# EAGLE schematic eagle0_komponenty (EAGLE 8.7.1)
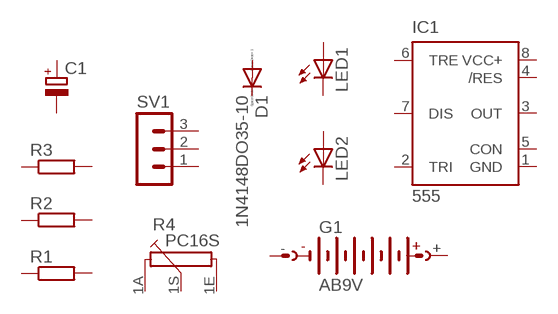
[diagram p0: schematic, sheet 1]

## Parts
C1  CPOL-EUE3.5-8  [E3,5-8]
D1  1N4148DO35-10  [DO35-10]
G1  AB9V  [AB9V]
IC1  555  555P  [DIP08]
LED1  LED3MM  [LED3MM]
LED2  LED3MM  [LED3MM]
R1  R-EU_0207/10  [0207/10]
R2  R-EU_0207/10  [0207/10]
R3  R-EU_0207/10  [0207/10]
R4  PC16S  [PC16S]
SV1  MA03-1  [MA03-1]
Unconnected: C1.+ C1.- D1.A D1.C G1.+ G1.- IC1.2(TRI) IC1.3(OUT) IC1.4(/RES) IC1.5(CON) IC1.6(TRE) IC1.7(DIS) LED1.A LED1.K(C) LED2.A LED2.K(C) R1.1 R1.2 R2.1 R2.2 R3.1 R3.2 R4.1A R4.1E R4.1S SV1.1 SV1.2 SV1.3

## Power pins joined to a net without a drawn wire
GND: IC1.1(GND)
VCC+: IC1.8(VCC+)

## Library data of the parts
C1 = rcl:CPOL-EU: POLARIZED CAPACITOR, European symbol; SPICEPREFIX: C
D1 = diode:1N4148: DIODE high speed (Philips)
G1 = battery:AB9V: 9-V BATTERY CLIP
IC1 = SparkFun-IC-Special-Function:555: General purpose bipolar Timer Datasheet <http://www.sparkfun.com/datasheets/Components/General/ne555.pdf> SparkFun Products SparkFun SparkPunk Sequencer Kit <https://www.sparkfun.com/products/12707> (KIT-12707) Storefront Component: 555 Timer <https://www.sparkfun.com/products/9273> (COM-09273) Two parts valid for production: VFP: IC-11930 (M7555 PTH) VFP: IC-09173 (555 PTH) - Preferred; PROD_ID: IC-09173; PROD_ID_ALT: IC-09173
LED1 LED2 = led:LED: LED OSRAM: - CHIPLED LG R971, LG N971, LY N971, LG Q971, LY Q971, LO R971, LY R971 LH N974, LH R974 LS Q976, LO Q976, LY Q976 LO Q996 - Hyper CHIPLED LW Q18S LB Q993, LB Q99A, LB R99A - SideLED LS A670, LO A670, LY A670, LG A670, LP A670 LB A673, LV A673, LT A673, LW A673 LH A674 LY A675 LS A676, LA A676, LO A676, LY A676, LW A676 LS A679, LY A679, LG A679 - Hyper Micro SIDELED® LS Y876, LA Y876, LO Y876, LY Y876 LT Y87S - SmartLED LW L88C, LW L88S LB L89C, LB L89S, LG L890 LS L89K, LO L89K, LY L89K LS L896, LA L896, LO L896, LY L896 - TOPLED LS T670, LO T670, LY T670, LG T670, LP T670 LSG T670, LSP T670, LSY T670, LOP T670, LYG T670 LG T671, LOG T671, LSG T671 LB T673, LV T673, LT T673, LW T673 LH T674 LS T676, LA T676, LO T676, LY T676, LB T676, LH T676, LSB T676, LW T676 LB T67C, LV T67C, LT T67C, LS T67K, LO T67K, LY T67K, LW E67C LS E67B, LA E67B, LO E67B, LY E67B, LB E67C, LV E67C, LT E67C LW T67C LS T679, LY T679, LG T679 LS T770, LO T770, LY T770, LG T770, LP T770 LB T773, LV T773, LT T773, LW T773 LH T774 LS E675, LA E675, LY E675, LS T675 LS T776, LA T776, LO T776, LY T776, LB T776 LHGB T686 LT T68C, LB T68C - Hyper Mini TOPLED® LB M676 - Mini TOPLED Santana® LG M470 LS M47K, LO M47K, LY M47K Source: http://www.osram.convergy.de LUXEON: - LUMILED® LXK2-PW12-R00, LXK2-PW12-S00, LXK2-PW14-U00, LXK2-PW14-V00 LXK2-PM12-R00, LXK2-PM12-S00, LXK2-PM14-U00 LXK2-PE12-Q00, LXK2-PE12-R00, LXK2-PE12-S00, LXK2-PE14-T00, LXK2-PE14-U00 LXK2-PB12-K00, LXK2-PB12-L00, LXK2-PB12-M00, LXK2-PB14-N00, LXK2-PB14-P00, LXK2-PB14-Q00 LXK2-PR12-L00, LXK2-PR12-M00, LXK2-PR14-Q00, LXK2-PR14-R00 LXK2-PD12-Q00, LXK2-PD12-R00, LXK2-PD12-S00 LXK2-PH12-R00, LXK2-PH12-S00 LXK2-PL12-P00, LXK2-PL12-Q00, LXK2-PL12-R00 Source: www.luxeon.com KINGBRIGHT: KA-3528ASYC Source: www.kingbright.com
R1-R3 = rcl:R-EU_: RESISTOR, European symbol; SPICEPREFIX: R
R4 = piher:PC16S: POTENTIOMETER single carbon potentiometer, 16 mm, S3ROH; OC_FARNELL: 4452940; OC_NEWARK: unknown
SV1 = con-lstb:MA03-1: PIN HEADER; OC_FARNELL: unknown; OC_NEWARK: unknown